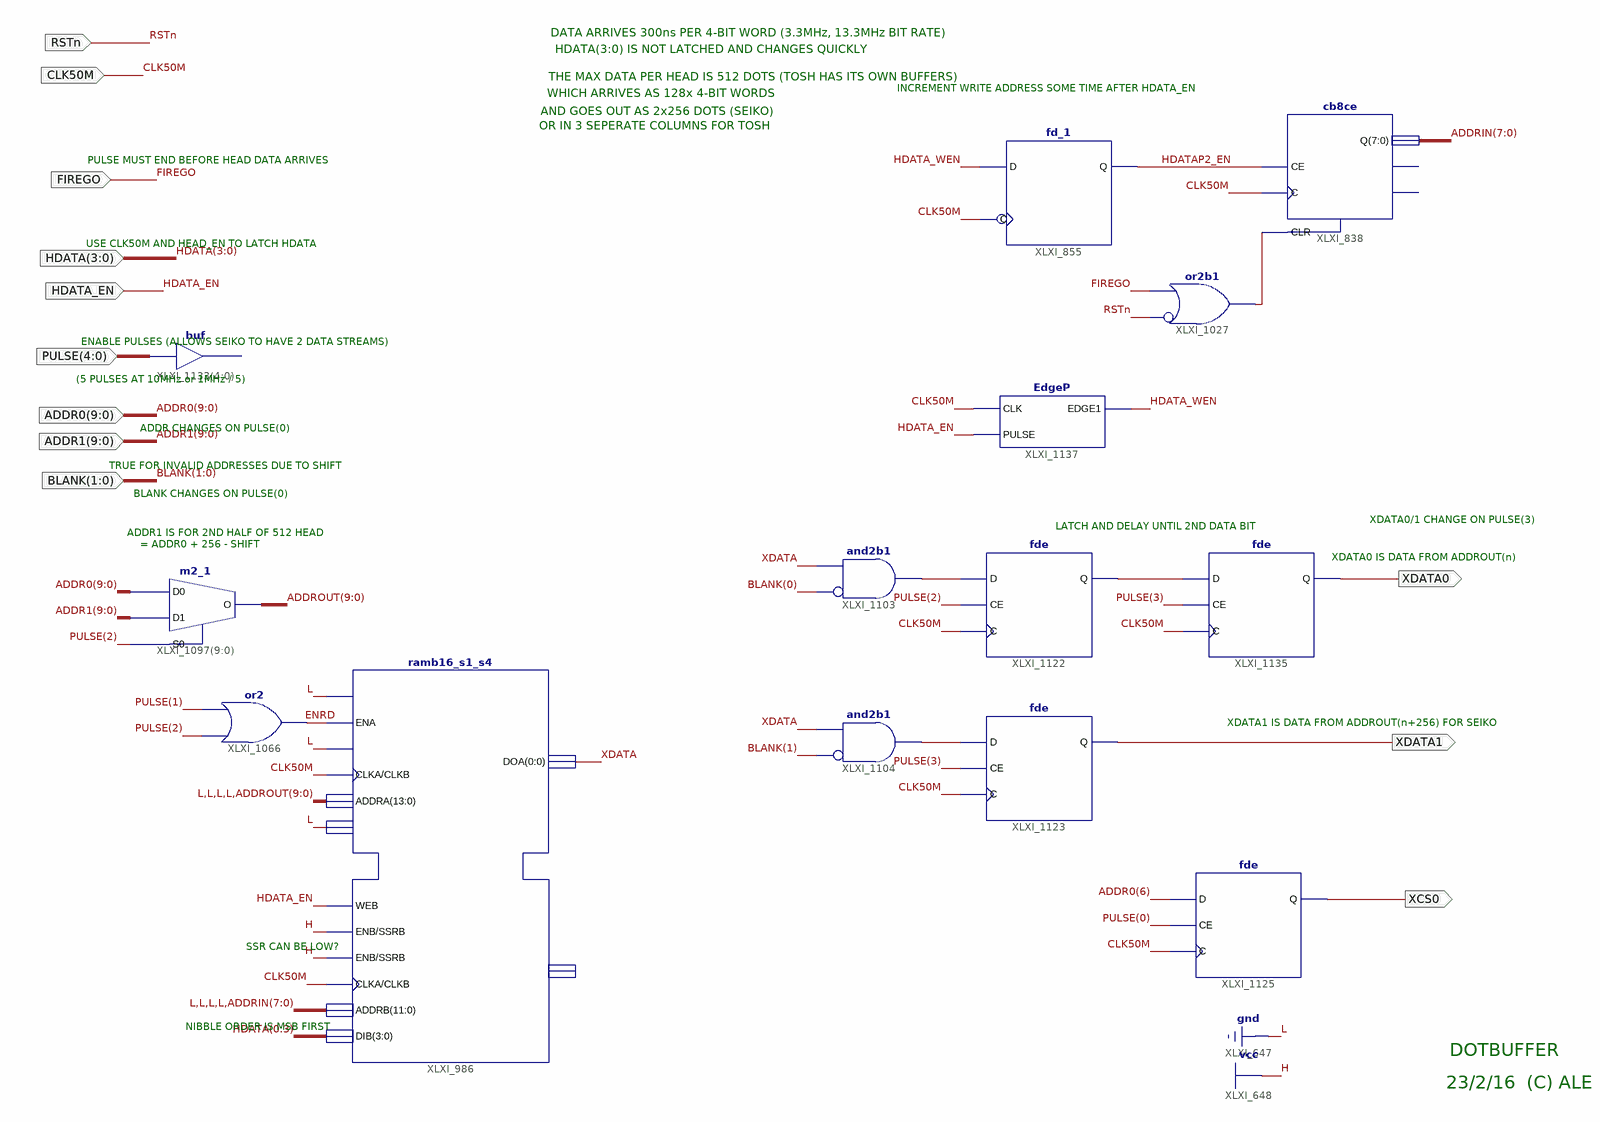
[diagram p0: schematic sheet 1]
// Xilinx ISE schematic DB_DotBuffer.sch (spartan3e) as structural Verilog: 14 symbols, 12 ports
module DB_DotBuffer (
  input  RSTn,
  input  FIREGO,
  input  HDATA_EN,
  input  [3:0] HDATA,
  input  CLK50M,
  input  [9:0] ADDR0,
  input  [9:0] ADDR1,
  input  [4:0] PULSE,
  input  [1:0] BLANK,
  output XCS0,
  output XDATA1,
  output XDATA0
);

  wire ENRD, HDATA_WEN, HDATAP2_EN, XDATA, XLXN_1152, XLXN_1642, XLXN_1658, XLXN_1678;
  wire [7:0] ADDRIN;
  wire [9:0] ADDROUT;

  cb8ce XLXI_838 (.C(CLK50M), .CE(HDATAP2_EN), .CLR(XLXN_1152), .Q(ADDRIN));  // open: CEO, TC
  or XLXI_1027 (XLXN_1152, ~RSTn, FIREGO);  // or2b1
  fd_1 XLXI_855 (.C(CLK50M), .D(HDATA_WEN), .Q(HDATAP2_EN));
  or XLXI_1066 (ENRD, PULSE[2], PULSE[1]);
  fde XLXI_1123 (.C(CLK50M), .CE(PULSE[3]), .D(XLXN_1642), .Q(XDATA1));
  fde XLXI_1125 (.C(CLK50M), .CE(PULSE[0]), .D(ADDR0[6]), .Q(XCS0));
  ramb16_s1_s4 XLXI_986 (
    .ADDRA({4'b0000, ADDROUT}), .ADDRB({4'b0000, ADDRIN}), .CLKA(CLK50M), .CLKB(CLK50M), .DIA(1'b0),
    .DIB({HDATA[0], HDATA[1], HDATA[2], HDATA[3]}), .ENA(ENRD), .ENB(1'b1), .SSRA(1'b0), .SSRB(1'b1),
    .WEA(1'b0), .WEB(HDATA_EN), .DOA(XDATA));  // open: DOB
  and XLXI_1104 (XLXN_1642, ~BLANK[1], XDATA);  // and2b1
  and XLXI_1103 (XLXN_1658, ~BLANK[0], XDATA);  // and2b1
  // buf XLXI_1133[4..0] has open pins: I=PULSE, O=open
  fde XLXI_1122 (.C(CLK50M), .CE(PULSE[2]), .D(XLXN_1658), .Q(XLXN_1678));
  fde XLXI_1135 (.C(CLK50M), .CE(PULSE[3]), .D(XLXN_1678), .Q(XDATA0));
  m2_1 XLXI_1097[9:0] (.D0(ADDR0), .D1(ADDR1), .S0(PULSE[2]), .O(ADDROUT));
  EdgeP XLXI_1137 (.CLK(CLK50M), .EDGE1(HDATA_WEN), .PULSE(HDATA_EN));

  // Notes on the sheet:
  //   DATA ARRIVES 300ns PER 4-BIT WORD (3.3MHz, 13.3MHz BIT RATE)
  //   HDATA(3:0) IS NOT LATCHED AND CHANGES QUICKLY
  //   THE MAX DATA PER HEAD IS 512 DOTS (TOSH HAS ITS OWN BUFFERS)
  //   INCREMENT WRITE ADDRESS SOME TIME AFTER HDATA_EN
  //   WHICH ARRIVES AS 128x 4-BIT WORDS
  //   AND GOES OUT AS 2x256 DOTS (SEIKO)
  //   OR IN 3 SEPERATE COLUMNS FOR TOSH
  //   PULSE MUST END BEFORE HEAD DATA ARRIVES
  //   USE CLK50M AND HEAD_EN TO LATCH HDATA
  //   ENABLE PULSES (ALLOWS SEIKO TO HAVE 2 DATA STREAMS)
  //   (5 PULSES AT 10MHz or 1MHz / 5)
  //   ADDR CHANGES ON PULSE(0)
  //   TRUE FOR INVALID ADDRESSES DUE TO SHIFT
  //   BLANK CHANGES ON PULSE(0)
  //   XDATA0/1 CHANGE ON PULSE(3)
  //   LATCH AND DELAY UNTIL 2ND DATA BIT
  //   ADDR1 IS FOR 2ND HALF OF 512 HEAD
  //   = ADDR0 + 256 - SHIFT
  //   XDATA0 IS DATA FROM ADDROUT(n)
  //   XDATA1 IS DATA FROM ADDROUT(n+256) FOR SEIKO
  //   SSR CAN BE LOW?
  //   NIBBLE ORDER IS MSB FIRST
  //   DOTBUFFER
  //   23/2/16  (C) ALE
endmodule
